# EAGLE design SwitchNode (EAGLE 7.2.0)
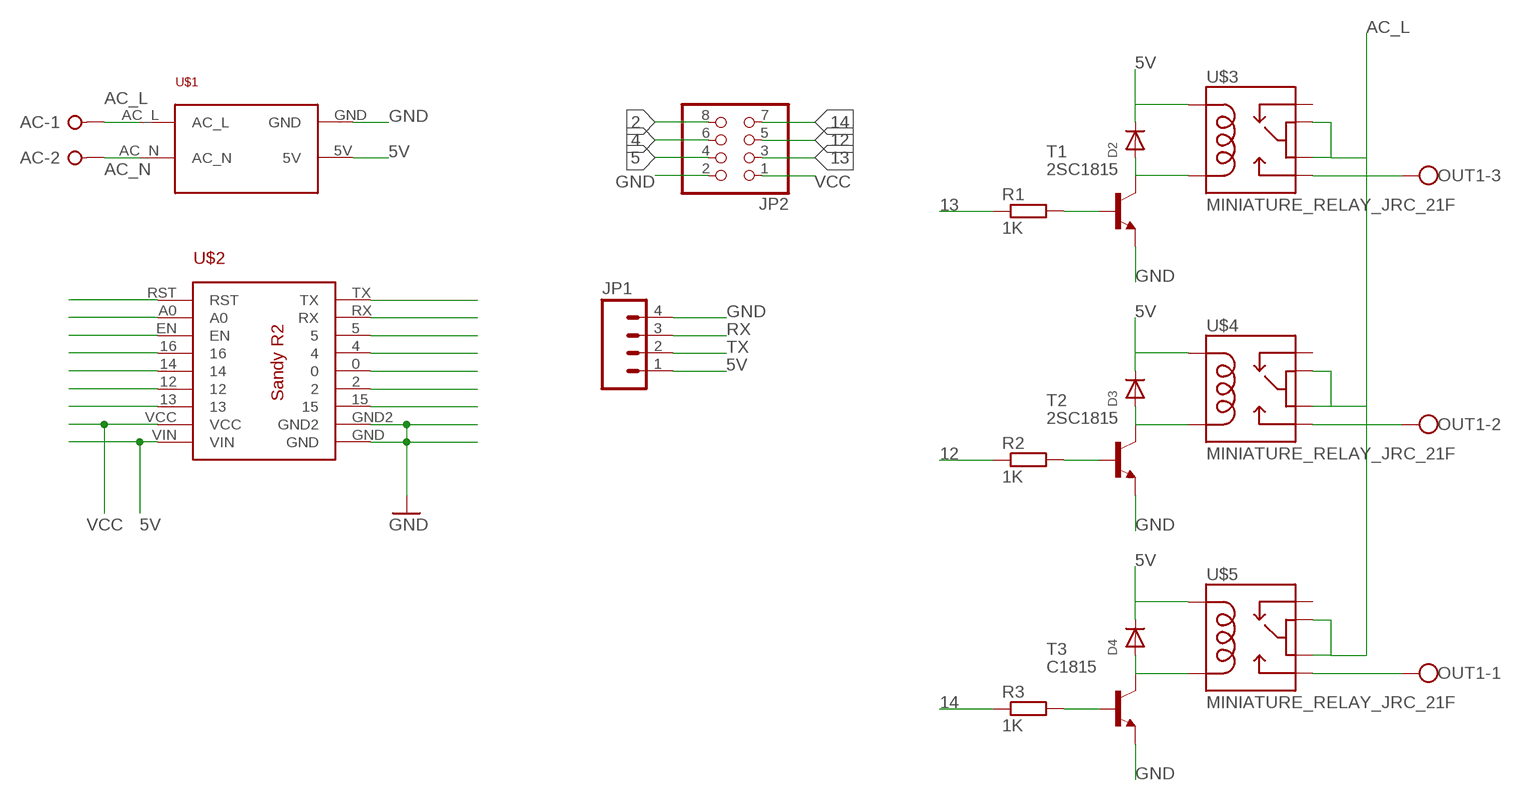
[diagram p0: schematic, sheet 1]

## Parts
AC  W237-02P  [W237-132]
D2  DIODESMA  [SMADIODE]
D3  DIODESMA  [SMADIODE]
D4  DIODESMA  [SMADIODE]
JP1  M04PTH  [1X04]
JP2  PINHD-2X4  [2X04]
OUT1  W237-103  [W237-103]
R1  1K  R-EU_R0805  [R0805]
R2  1K  R-EU_R0805  [R0805]
R3  1K  R-EU_R0805  [R0805]
T1  2SC1815  [TO92-ECB]
T2  2SC1815  [TO92-ECB]
T3  C1815  2SC1815  [TO92-ECB]
U$1  POWER_SUPPLY_220VAC_5V  [POWER_SUPPLY_220VAC_5V]
U$2  MINI-ESP  [MINI-ESP]
U$3  MINIATURE_RELAY_JRC_21F  [MINIATURE_RELAY_JRC_21F]
U$4  MINIATURE_RELAY_JRC_21F  [MINIATURE_RELAY_JRC_21F]
U$5  MINIATURE_RELAY_JRC_21F  [MINIATURE_RELAY_JRC_21F]

## Nets
0: U$2.0
2: JP2.8 U$2.2
4: JP2.6 U$2.4
5: JP2.4 U$2.5
5V: D2.C D3.C D4.C JP1.1 U$1.5V U$2.VIN U$3.COIL1 U$4.COIL1 U$5.COIL1
12: JP2.5 R2.1 U$2.12
13: JP2.3 R1.1 U$2.13
14: JP2.7 R3.1 U$2.14
16: U$2.16
A0: U$2.A0
AC_L: AC.1 U$1.AC_L U$3.COM1 U$3.COM2 U$4.COM1 U$4.COM2 U$5.COM1 U$5.COM2
AC_N: AC.2 U$1.AC_N
D8: U$2.15
EN: U$2.EN
GND: JP1.4 JP2.2 T1.E T2.E T3.E U$1.GND U$2.GND U$2.GND2
N$1: D2.A T1.C U$3.COIL2
N$3: D3.A T2.C U$4.COIL2
N$4: D4.A T3.C U$5.COIL2
N$5: R3.2 T3.B
N$6: R2.2 T2.B
N$7: R1.2 T1.B
N$8: OUT1.3 U$3.NO
N$11: OUT1.1 U$5.NO
N$12: OUT1.2 U$4.NO
RST: U$2.RST
RX: JP1.3 U$2.RX
TX: JP1.2 U$2.TX
VCC: JP2.1 U$2.VCC
Unconnected: U$3.NC U$4.NC U$5.NC

## Library data of the parts
AC = con-wago-508:W237-02P: WAGO SREW CLAMP; OC_FARNELL: unknown; OC_NEWARK: unknown
D2-D4 = adafruit:DIODE: Diode SMADIODE - SMA Surface Mount Package 20V 1A Schottky Diode Digikey: 641-1014-6-ND DO-1N4148 - Through Hole Small Current Diode SOD-123 20V 1 A (.5mV Vf) Schottky Diode - Digikey: MBRX120TPMSCT-ND SOD-323 10V 570mA (.38mV Vf, 3ns) Schottky Diode - Digikey: ZLLS410CT-ND SOD-523 30V 30mA Schottky Diode (RB751S-40TE61) - Digikey: RB751S-40TE61CT-ND SOT23-R/W - SOT23 Package (R = Solder Paste/Reflow Ovens, W = Hand-Soldering) BAT54Film 40V 300mA - Digikey: 497-7162-1-ND
JP1 = SparkFun-Connectors:M04: Header 4 Standard 4-pin 0.1" header. Use with straight break away headers (SKU : PRT-00116), right angle break away headers (PRT-00553), swiss pins (PRT-00743), machine pins (PRT-00117), and female headers (PRT-00115). Molex polarized connector foot print use with SKU : PRT-08231 with associated crimp pins and housings. 1MM SMD Version SKU: PRT-10208
JP2 = adafruit:PINHD-2X4: PIN HEADER
OUT1 = con-wago-500:W237-103: WAGO SCREW CLAMP; MPN: 237-103; OC_FARNELL: unknown; OC_NEWARK: 18M7116
R1-R3 = rcl:R-EU_: RESISTOR, European symbol
T1-T3 = transistor:2SC1815: NPN EPITAXIAL TRANSISTOR Source: TOSHIBA .. 2SC1815 1.pdf
U$1 = My Eagle Lib:POWER_SUPPLY_220VAC_5V
U$2 = My Eagle Lib:MINI-ESP
U$3-U$5 = My Eagle Lib:MINIATURE_RELAY_JRC_21F

## Board
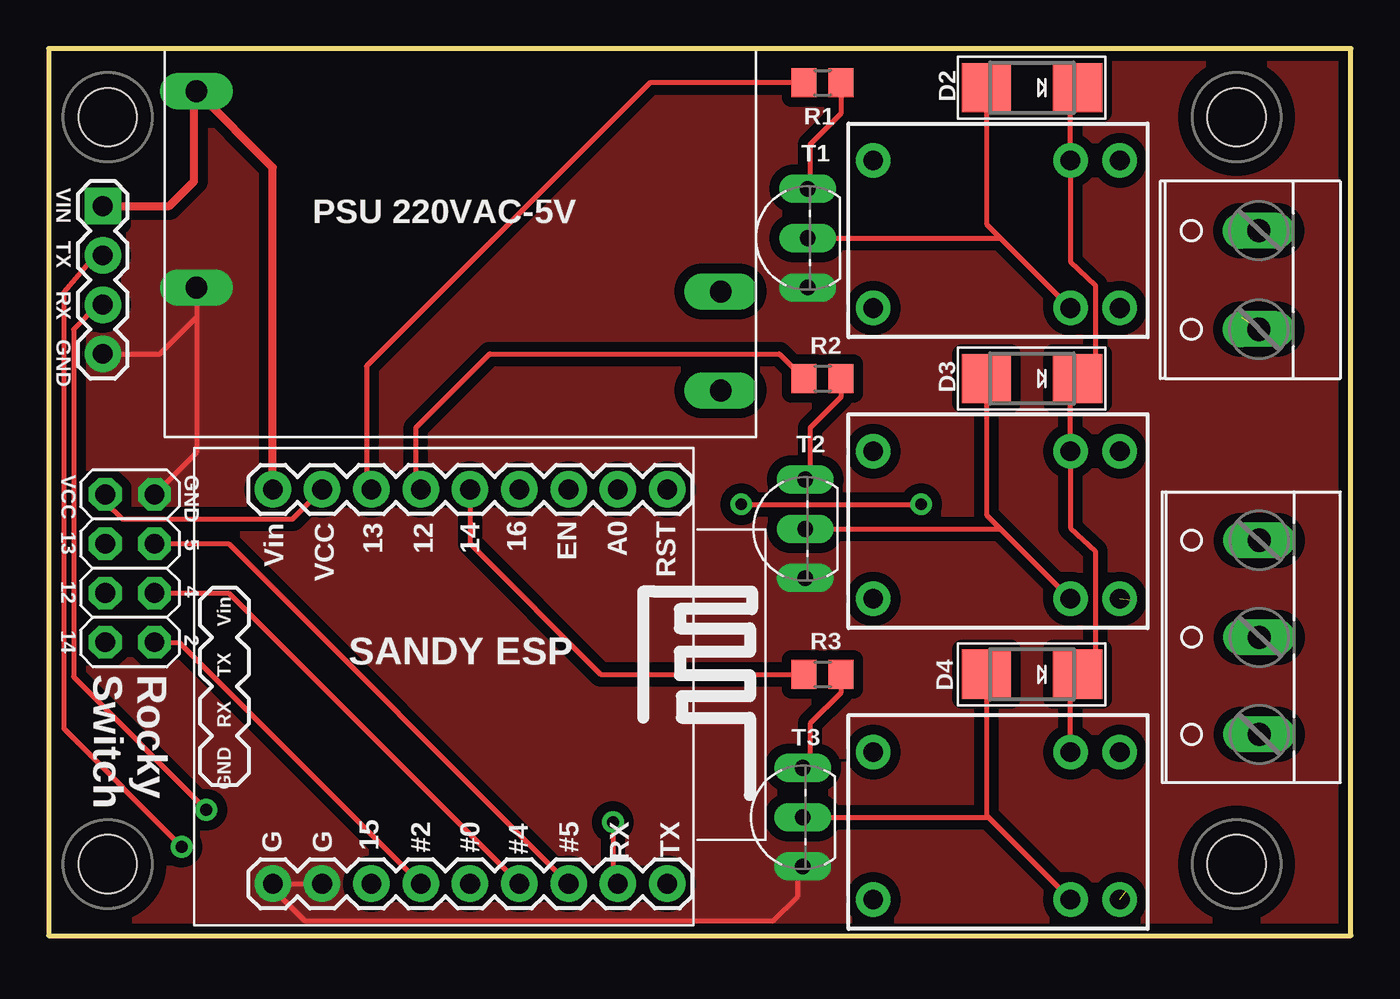
[diagram p1: board, top side]
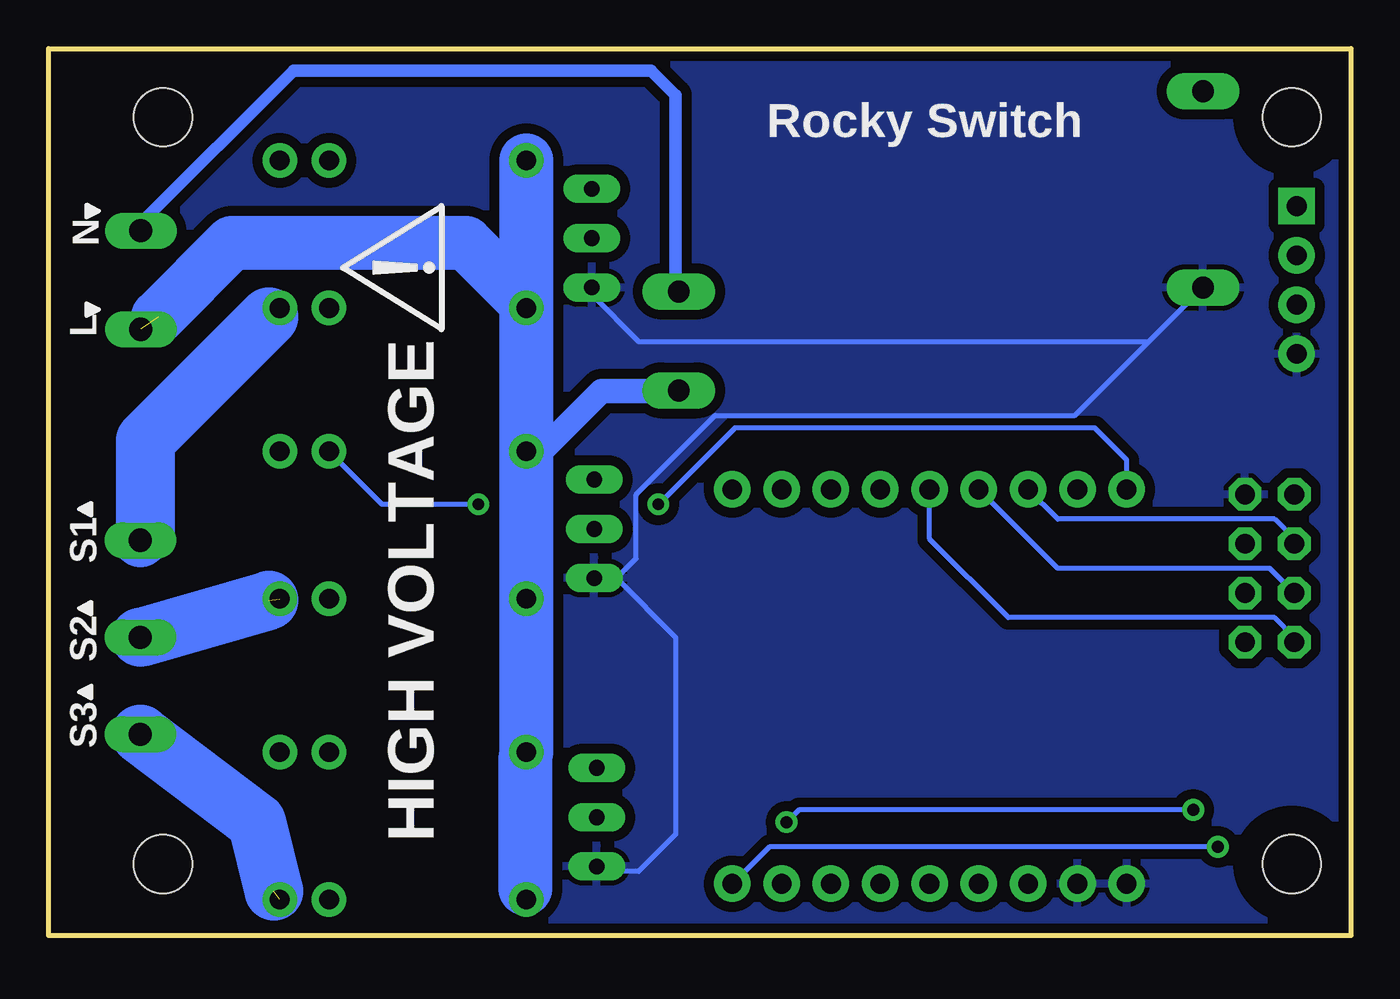
[diagram p2: board, bottom side, seen from below]

Size 67.11 x 45.71 mm. Coordinates in mm from the lower left corner, seen from the top.
Outline: 0,0 67.11,0 67.11,45.71 0,45.71 0,0
Copper layers (1*16): Top 0.035mm / dielectric 1.5mm / Bottom 0.035mm
Design rules "default *": minimum track width 10mil, minimum drill 24mil, track to track 10mil, track to pad 10mil, pad to pad 10mil, via to via 10mil, smd to smd 8mil, copper to edge 20mil, drill to drill 12mil, minimum pad ring 13mil, minimum via ring 10mil, stop-mask expansion 4mil, vias tented up to drill 0mil, thermal gap 10mil

### Footprints (pad centres in the part's own frame; a part is rotated, then mirrored left to right if it is on the bottom)
W237-132 = drill 1.194 long: 1 -2.54,-0.635; 2 2.54,-0.635
SMADIODE = smd 2.54 x 2.54: A 2.349,0; C -2.349,0
1X04 = drill 1.016 pad 1.88 square: 1 0,0 | drill 1.016 pad 1.88: 2 2.54,0; 3 5.08,0; 4 7.62,0
2X04 = drill 1.016 pad 1.676 octagon: 1 -3.81,-1.27; 2 -3.81,1.27; 3 -1.27,-1.27; 4 -1.27,1.27; 5 1.27,-1.27; 6 1.27,1.27; 7 3.81,-1.27; 8 3.81,1.27
W237-103 = drill 1.194 long: 1 -5,-1.29; 2 0,-1.29; 3 5,-1.29
R0805 = smd 1.3 x 1.5: 1 -0.95,0; 2 0.95,0
TO92-ECB = drill 0.813 long: B 2.54,0; C 0,0; E -2.54,0
POWER_SUPPLY_220VAC_5V = drill 1.118 pad 1.88 long: 5V 13.2,-7.82; AC_L -13.8,7.6; AC_N -13.8,2.5; GND 13.2,2.3
MINI-ESP = drill 1.016 pad 1.88: 0 10.16,1.524; 2 10.16,-1.016; 4 10.16,4.064; 5 10.16,6.604; 12 -10.16,-1.016; 13 -10.16,-3.556; 14 -10.16,1.524; 15 10.16,-3.556; 16 -10.16,4.064; A0 -10.16,9.144; EN -10.16,6.604; GND 10.16,-8.636; GND2 10.16,-6.096; RST -10.16,11.684; RX 10.16,9.144; TX 10.16,11.684; VCC -10.16,-6.096; VIN -10.16,-8.636
MINIATURE_RELAY_JRC_21F = drill 1.016 pad 1.778: COIL1 3.81,2.6; COIL2 3.81,-5; COM1 -6.35,2.6; COM2 -6.35,-5; NC 6.35,2.6; NO 6.35,-5
KFH-M3 = hole 3: 0,0

### Placement (x,y rotation side)
AC  61.72,33.78 90 top
D2  50.67,43.69 180 top
D3  50.67,28.7 180 top
D4  50.67,13.46 180 top
JP1  2.79,37.59 270 top
JP2  4.19,18.92 270 top
OUT1  61.09,15.37 90 top
R1  39.88,43.94 0 top
R2  39.88,28.7 0 top
R3  39.88,13.46 0 top
T1  39.12,35.94 90 top
T2  38.99,20.95 90 top
T3  38.86,6.1 90 top
U$1  20.83,35.69 180 top
U$2  20.19,12.83 270 top
U$3  48.84,37.34 0 top
U$4  48.84,22.35 0 top
U$5  48.84,6.86 0 top
U$6  [KFH-M3]  3.05,3.68 0 top
U$7  [KFH-M3]  61.21,3.68 0 top
U$8  [KFH-M3]  61.21,42.16 0 top
U$9  [KFH-M3]  3.05,42.16 0 top
U$11  [ICON_PIN1_B]  64.52,37.34 180 bottom
U$12  [ICON_PIN1_B]  64.52,32.26 180 bottom
U$13  [ICON_PIN1_B]  65.53,21.97 0 bottom
U$14  [ICON_PIN1_B]  65.53,16.87 0 bottom
U$15  [ICON_PIN1_B]  65.53,12.55 0 bottom
U$17  [ICON_EXL-S]  48.77,34.42 90 bottom

### Tracks (layer width: path | path; a pad name or v marks a point on that pad's centre or on a via)
2
  Top 0.254: JP2.8 6.73,15.11 U$2.2
4
  Top 0.254: JP2.6 9.27,17.65 U$2.4
5
  Top 0.254: JP2.4 9.27,20.19 U$2.5
5V  (via drill 0.61)
  Top 0.254: D2.C 52.65,43.32 U$3.COIL1 52.65,34.72 53.92,33.53 53.92,29.53 D3.C 52.65,28.33 U$4.COIL1 52.65,21.01 53.92,19.81 53.92,14.29 D4.C 52.65,13.09 U$5.COIL1 | v35.69,22.23 v44.96,22.23
  Top 0.406: U$2.VIN 11.56,39.58 U$1.5V 7.49,43.37 7.49,38.86 6.22,37.59 JP1.1
  Bottom 0.254: U$2.VIN 11.56,24.51 13.21,26.16 31.75,26.16 v35.69,22.23 | v44.96,22.23 49.93,22.23 U$4.COIL1
12
  Top 0.254: U$2.12 18.92,23.24 18.92,26.16 22.73,29.97 37.66,29.97 R2.1
  Bottom 0.254: JP2.5 4.19,18.92 15.11,18.92 U$2.12
13
  Top 0.254: R1.1 30.99,43.94 16.38,29.34 16.38,23.24 U$2.13
  Bottom 0.254: U$2.13 15.11,21.46 3.94,21.46 2.92,20.45 JP2.3
14
  Top 0.254: U$2.14 21.72,20.19 28.45,13.46 R3.1
  Bottom 0.254: JP2.7 2.92,15.37 3.94,16.38 17.65,16.38 21.72,20.45 U$2.14
AC_L  (1 unrouted)
  Bottom 0.406: 42.54,2.41 42.49,2.59 U$5.COM2
  Bottom 1.27: U$4.COM1 41.72,24.95 38.61,28.07 34.65,28.07 U$1.AC_L
  Bottom 2.54: U$5.COM1 42.54,9.13
  Bottom 2.794: U$3.COM2 U$4.COM1 U$4.COM2 U$5.COM1 | U$3.COM2 42.49,32.59 45.59,35.69 57.66,35.69 61.47,31.88 | U$3.COM1 U$3.COM2 | 42.54,9.13 42.54,2.41
AC_N
  Bottom 0.635: AC.2 62.36,36.7 54.48,44.58 36.07,44.58 34.8,43.31 34.8,33.36 U$1.AC_N
GND
  Top 0.254: T3.E 38.61,3.3 38.61,2.03 37.34,0.76 13.21,0.76 11.56,2.41 U$2.GND U$2.GND2 | U$1.GND 7.63,31.88 | 7.63,31.88 7.63,24.9 JP2.2 | JP1.4 5.72,29.97 7.63,31.88
  Bottom 0.254: T2.E 37.85,18.41 | 37.85,18.41 34.8,15.37 34.8,5.21 36.7,3.3 38.61,3.3 T3.E | T1.E 39.12,33.02 36.7,30.61 10.41,30.61 U$1.GND 14.22,26.8 32.77,26.8 36.83,22.73 36.83,19.43 37.85,18.41
  pour Bottom (isolate 0.508): -4.57,47.75 76.33,47.63 76.33,-3.81 -4.57,-3.68
  pour Top (isolate 0.508, no thermals): -4.57,47.75 76.33,47.63 76.33,-3.81 -4.57,-3.68
N$1
  Top 0.254: T1.C 49.05,35.94 | 49.05,35.94 49.35,35.64 U$3.COIL2 | D2.A 48.32,36.67 49.05,35.94
N$3
  Top 0.254: T2.C 49.05,20.95 | 49.05,20.95 49.48,20.52 U$4.COIL2 | D3.A 48.32,21.68 49.05,20.95
N$4
  Top 0.254: T3.C 48.42,6.1 | 48.42,6.1 49.35,5.16 U$5.COIL2 | D4.A 48.32,6.19 48.42,6.1
N$5
  Top 0.254: R3.2 40.83,12.51 39.24,10.92 39.24,9.02 T3.B
N$6
  Top 0.254: R2.2 40.83,27.75 39.24,26.16 39.24,23.75 T2.B
N$7
  Top 0.254: R1.2 40.83,42.35 39.24,40.77 39.24,38.61 T1.B
N$8
  Bottom 0.229: 55.19,32.44 U$3.NO 62.74,24.79 62.74,24.26 | 55.19,32.44 55.12,32.51 | 55.19,32.44 55.75,31.88
  Bottom 2.794: OUT1.3 62.1,20.77
  Bottom 3.048: 62.1,20.77 62.1,25.53 55.75,31.88
N$11  (1 unrouted)
  Bottom 3.048: OUT1.1 56.39,5.84 55.5,2.29
N$12  (1 unrouted)
  Bottom 3.048: OUT1.2 55.75,17.27
RX  (via drill 0.61)
  Top 0.254: JP1.3 2.54,32.51 1.3,31.24 1.3,13.34 v8.13,6.48 | v29.08,5.84 29.08,2.92 U$2.RX
  Bottom 0.254: v8.13,6.48 28.45,6.48 v29.08,5.84
TX  (via drill 0.61)
  Top 0.254: JP1.2 2.41,35.05 0.79,33.15 0.79,10.67 v6.86,4.57
  Bottom 0.254: v6.86,4.57 29.97,4.57 U$2.TX
VCC
  Top 0.254: JP2.1 2.92,22.35 3.81,21.46 12.57,21.46 U$2.VCC

### Text on the board
tNames: VIN | PSU 220VAC-5V | TX | RX | GND | VCC | GND | 13 | 5 | 12 | 4 | 14 | 2 | Rocky / Switch
bNames: Rocky Switch | N | L | S1 | S2 | S3 | HIGH VOLTAGE